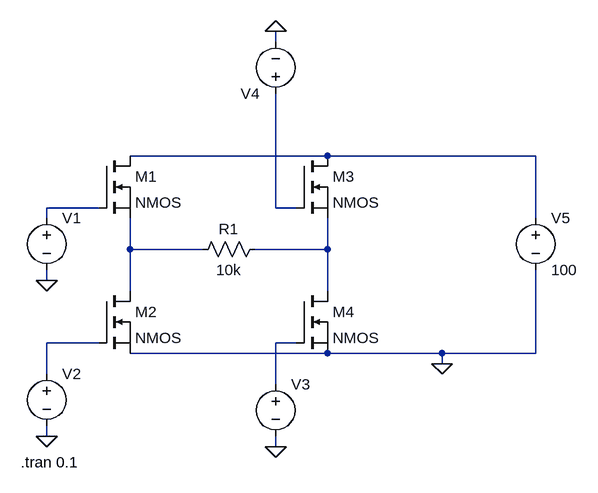
[diagram p0: schematic invmono_analise.asc]
invmono_analise.asc, the LTspice schematic file:
Version 4.1
SHEET 1 888 680
WIRE 416 -96 416 -112
WIRE 496 80 192 80
WIRE 816 80 496 80
WIRE 144 160 64 160
WIRE 416 160 416 -16
WIRE 448 160 416 160
WIRE 64 176 64 160
WIRE 816 176 816 80
WIRE 192 224 192 176
WIRE 304 224 192 224
WIRE 496 224 496 176
WIRE 496 224 384 224
WIRE 64 272 64 256
WIRE 192 288 192 224
WIRE 496 288 496 224
WIRE 144 368 64 368
WIRE 448 368 416 368
WIRE 496 384 192 384
WIRE 672 384 496 384
WIRE 816 384 816 256
WIRE 816 384 672 384
WIRE 672 400 672 384
WIRE 64 416 64 368
WIRE 416 432 416 368
WIRE 64 512 64 496
WIRE 416 528 416 512
FLAG 672 400 0
FLAG 64 272 0
FLAG 64 512 0
FLAG 416 528 0
FLAG 416 -112 0
SYMBOL nmos 144 80 R0
SYMATTR InstName M1
SYMBOL nmos 144 288 R0
SYMATTR InstName M2
SYMBOL nmos 448 80 R0
SYMATTR InstName M3
SYMBOL nmos 448 288 R0
SYMATTR InstName M4
SYMBOL res 400 208 R90
WINDOW 0 0 56 VBottom 2
WINDOW 3 32 56 VTop 2
SYMATTR InstName R1
SYMATTR Value 10k
SYMBOL voltage 64 160 R0
WINDOW 123 0 0 Left 0
WINDOW 39 0 0 Left 0
WINDOW 3 24 96 Invisible 2
SYMATTR InstName V1
SYMATTR Value PULSE(0 5 0 1u 1u 23u 50u)
SYMBOL voltage 64 400 R0
WINDOW 123 0 0 Left 0
WINDOW 39 0 0 Left 0
WINDOW 3 24 96 Invisible 2
SYMATTR InstName V2
SYMATTR Value PULSE(0 5 25u 1u 1u 25u 50u)
SYMBOL voltage 416 416 R0
WINDOW 123 0 0 Left 0
WINDOW 39 0 0 Left 0
WINDOW 3 24 96 Invisible 2
SYMATTR InstName V3
SYMATTR Value PULSE(0 5 25u 1u 1u 25u 50u)
SYMBOL voltage 416 0 R180
WINDOW 123 0 0 Left 0
WINDOW 39 0 0 Left 0
WINDOW 3 24 96 Invisible 2
SYMATTR InstName V4
SYMATTR Value PULSE(0 5 0 1u 1u 23u 50u)
SYMBOL voltage 816 160 R0
WINDOW 123 0 0 Left 0
WINDOW 39 0 0 Left 0
SYMATTR InstName V5
SYMATTR Value 100
TEXT 24 552 Left 2 !.tran 0.1

The netlist it stands for:
* invmono_analise.asc
M1 N001 N002 N004 N004 NMOS
M2 N004 N006 0 0 NMOS
M3 N001 N003 N005 N005 NMOS
M4 N005 N007 0 0 NMOS
R1 N005 N004 10k
V1 N002 0 PULSE(0 5 0 1u 1u 23u 50u)
V2 N006 0 PULSE(0 5 25u 1u 1u 25u 50u)
V3 N007 0 PULSE(0 5 25u 1u 1u 25u 50u)
V4 N003 0 PULSE(0 5 0 1u 1u 23u 50u)
V5 N001 0 100
.model NMOS NMOS
.model PMOS PMOS
.lib standard.mos
.tran 0.1
.backanno
.end